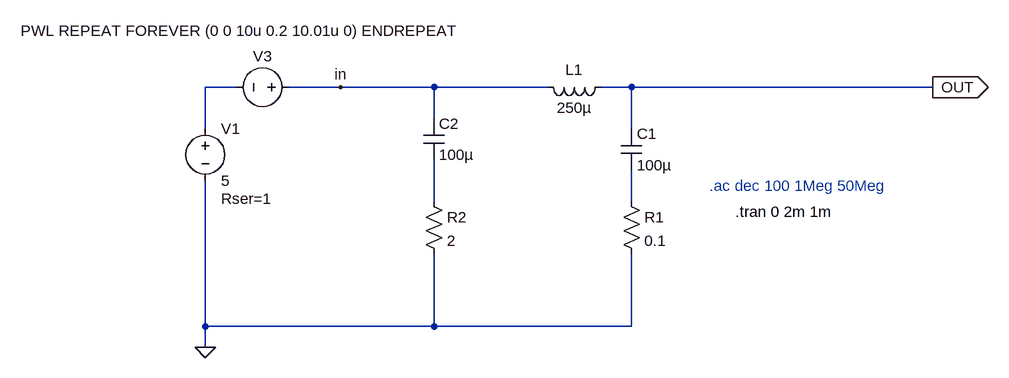
[diagram p0: schematic power-ripple-filter.asc]
power-ripple-filter.asc, the LTspice schematic file:
Version 4
SHEET 1 1748 680
WIRE -448 32 -496 32
WIRE -288 32 -368 32
WIRE -144 32 -288 32
WIRE 32 32 -144 32
WIRE 160 32 112 32
WIRE 624 32 160 32
WIRE -144 80 -144 32
WIRE -496 96 -496 32
WIRE 160 96 160 32
WIRE -144 208 -144 144
WIRE 160 208 160 160
WIRE -496 400 -496 176
WIRE -144 400 -144 288
WIRE -144 400 -496 400
WIRE 160 400 160 288
WIRE 160 400 -144 400
WIRE -496 432 -496 400
FLAG -496 432 0
FLAG 624 32 OUT
IOPIN 624 32 Out
FLAG -288 32 in
SYMBOL cap 144 96 R0
SYMATTR InstName C1
SYMATTR Value 100µ
SYMBOL cap -160 80 R0
SYMATTR InstName C2
SYMATTR Value 100µ
SYMBOL ind 128 16 R90
WINDOW 0 5 56 VBottom 2
WINDOW 3 32 56 VTop 2
SYMATTR InstName L1
SYMATTR Value 250µ
SYMBOL voltage -496 80 R0
WINDOW 123 0 0 Left 0
WINDOW 39 24 124 Left 2
SYMATTR SpiceLine Rser=1
SYMATTR InstName V1
SYMATTR Value 5
SYMBOL voltage -352 32 R90
WINDOW 0 -32 56 VBottom 2
WINDOW 3 -102 91 VTop 2
SYMATTR InstName V3
SYMATTR Value PWL REPEAT FOREVER (0 0 10u 0.2 10.01u 0) ENDREPEAT
SYMBOL res 144 192 R0
SYMATTR InstName R1
SYMATTR Value 0.1
SYMBOL res -160 192 R0
SYMATTR InstName R2
SYMATTR Value 2
TEXT 280 184 Left 2 ;.ac dec 100 1Meg 50Meg
TEXT 320 224 Left 2 !.tran 0 2m 1m

The netlist it stands for:
* power-ripple-filter.asc
C1 OUT N003 100µ
C2 in N002 100µ
L1 OUT in 250µ
V1 N001 0 5 Rser=1
V3 in N001 PWL REPEAT FOREVER (0 0 10u 0.2 10.01u 0) ENDREPEAT
R1 N003 0 0.1
R2 N002 0 2
* .ac dec 100 1Meg 50Meg
.tran 0 2m 1m
.backanno
.end